# Altium schematic sheet 20_ADC.SchDoc: ADC
size A3; Organization: Lime Microsystems; Address1: Surrey Tech Centre; Address2: Guildford GU2 7YG; Address3: Surrey; Address4: United Kingdom; Revision: v1.2; SheetNumber: 18; SheetTotal: 27
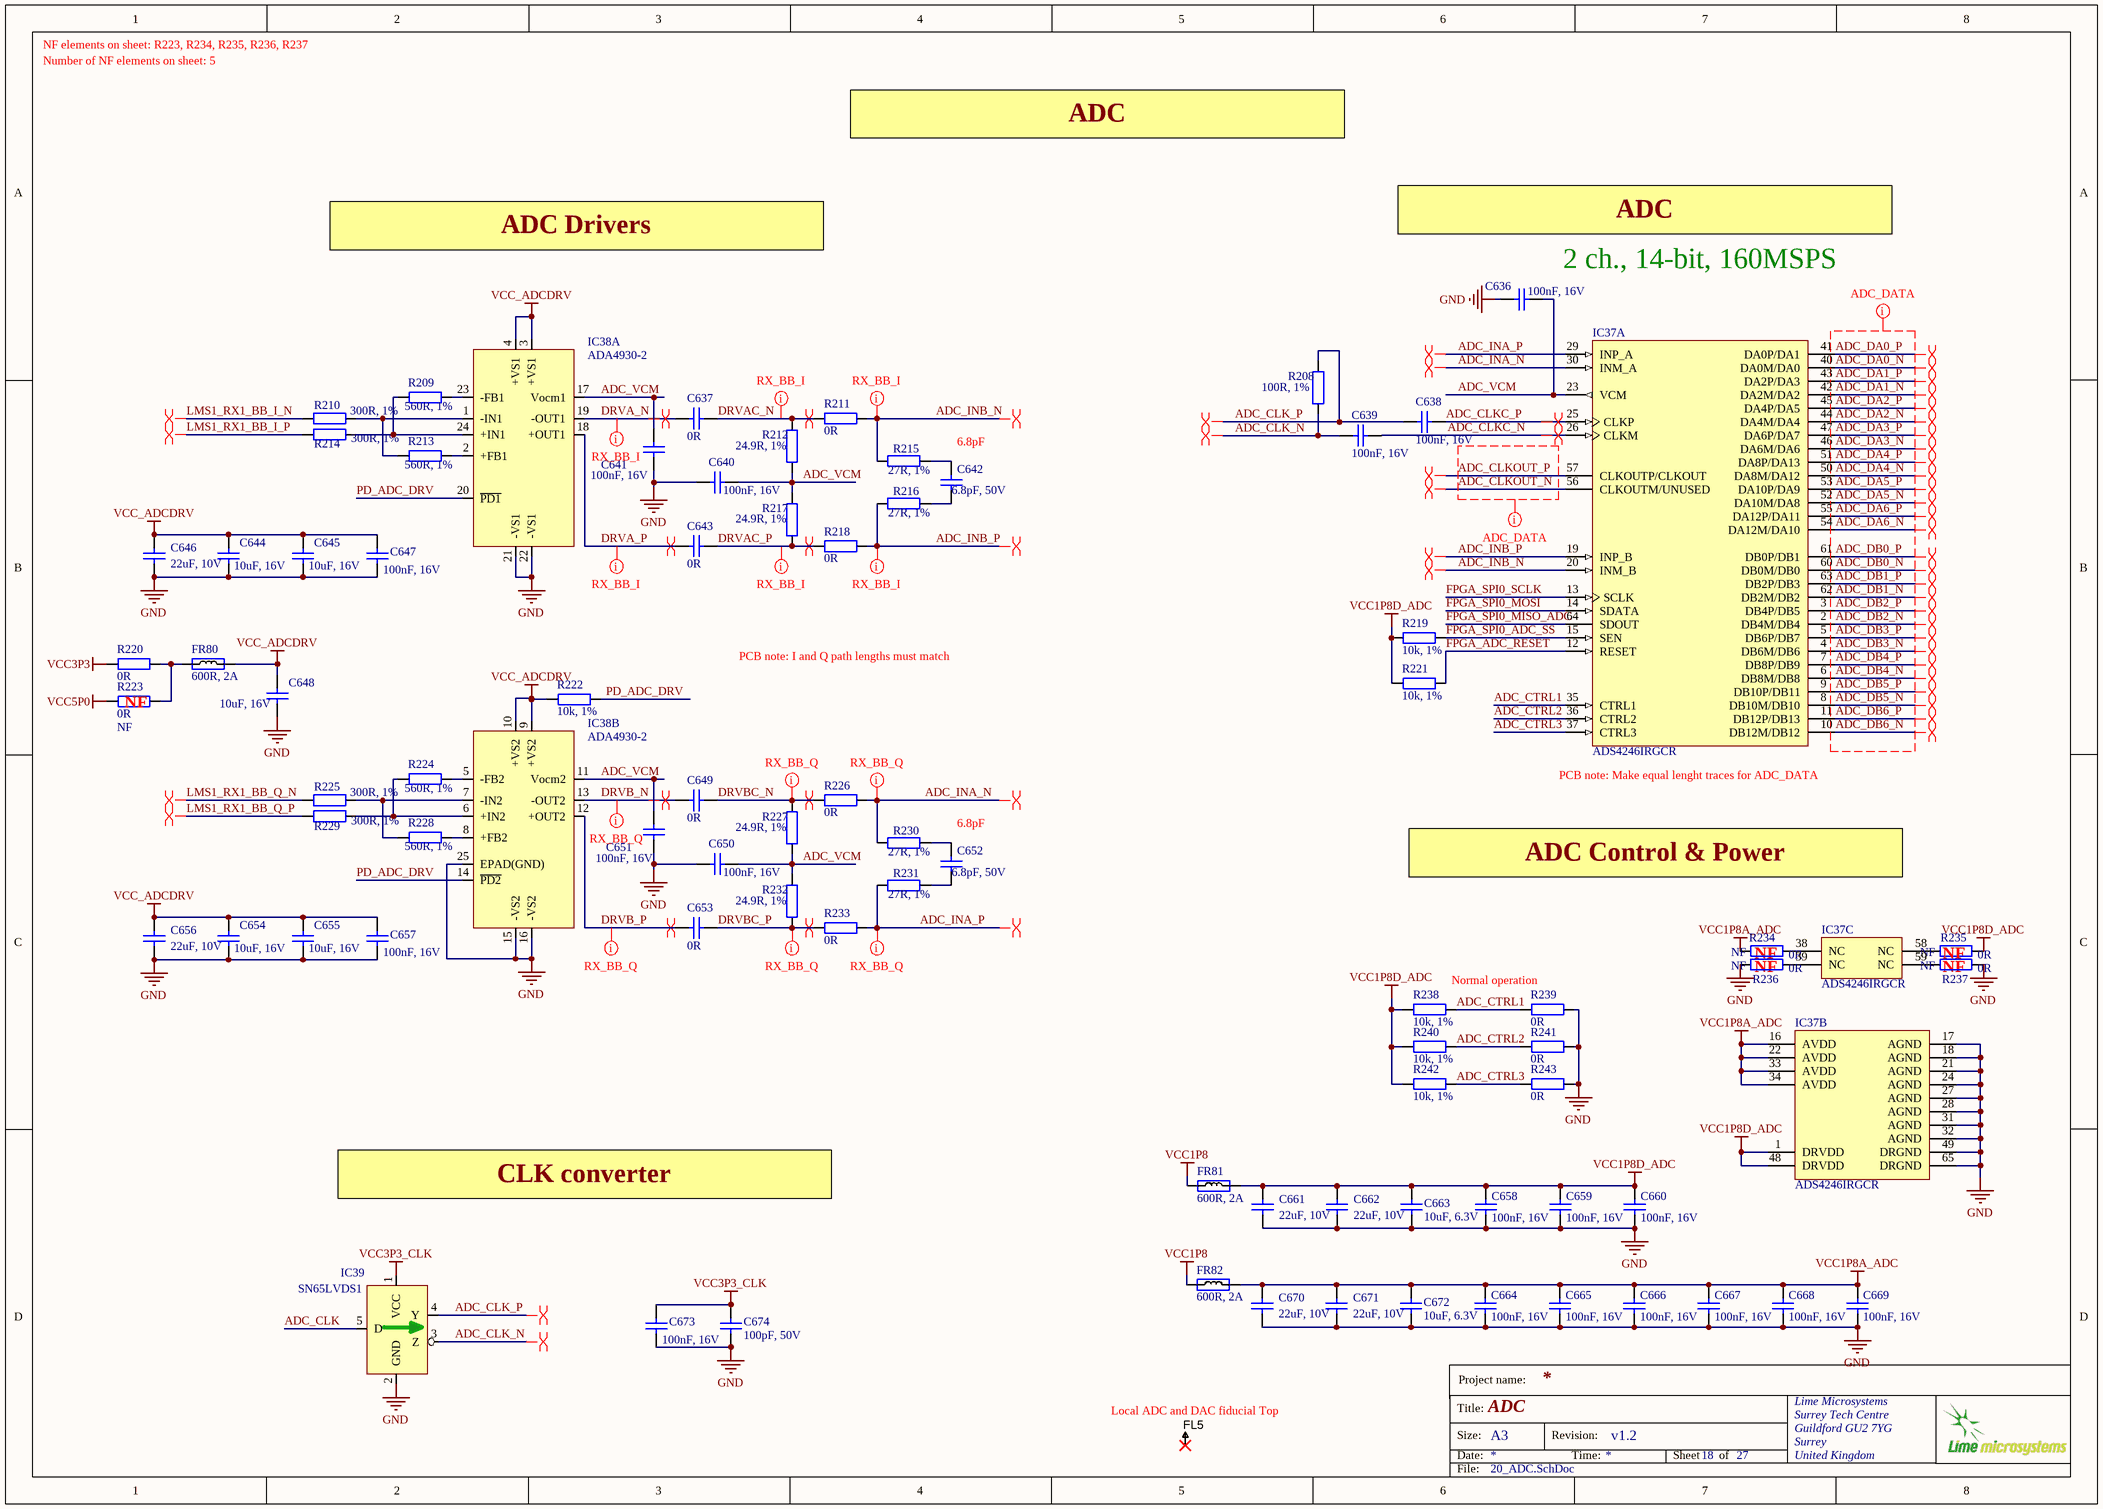
[diagram p0: 20_ADC.SchDoc]

## Parts
C636  100nF, 16V  [CAP0402]
C637  0R  [CAP0402]
C638  100nF, 16V  [CAP0402]
C639  100nF, 16V  [CAP0402]
C640  100nF, 16V  [CAP0402]
C641  100nF, 16V  [CAP0402]
C642  6.8pF, 50V  [CAP0402]
C643  0R  [CAP0402]
C644  10uF, 16V  [CAP0603]
C645  10uF, 16V  [CAP0603]
C646  22uF, 10V  [CAP0603]
C647  100nF, 16V  [CAP0402]
C648  10uF, 16V  [CAP0603]
C649  0R  [CAP0402]
C650  100nF, 16V  [CAP0402]
C651  100nF, 16V  [CAP0402]
C652  6.8pF, 50V  [CAP0402]
C653  0R  [CAP0402]
C654  10uF, 16V  [CAP0603]
C655  10uF, 16V  [CAP0603]
C656  22uF, 10V  [CAP0603]
C657  100nF, 16V  [CAP0402]
C658  100nF, 16V  [CAP0402]
C659  100nF, 16V  [CAP0402]
C660  100nF, 16V  [CAP0402]
C661  22uF, 10V  [CAP0603]
C662  22uF, 10V  [CAP0603]
C663  10uF, 6.3V  [CAP0603]
C664  100nF, 16V  [CAP0402]
C665  100nF, 16V  [CAP0402]
C666  100nF, 16V  [CAP0402]
C667  100nF, 16V  [CAP0402]
C668  100nF, 16V  [CAP0402]
C669  100nF, 16V  [CAP0402]
C670  22uF, 10V  [CAP0603]
C671  22uF, 10V  [CAP0603]
C672  10uF, 6.3V  [CAP0603]
C673  100nF, 16V  [CAP0402]
C674  100pF, 50V  [CAP0402]
FL5  Fiducial  [Fiducial_local]  (value not drawn)
FR80  600R, 2A  [RES0805]
FR81  600R, 2A  [RES0805]
FR82  600R, 2A  [RES0805]
IC37  ADS4246IRGCR  [TI-RGC64-7400X7400TP_V]  (parts A,B,C of 3)
IC38  ADA4930-2  [ADA4930-2_LFCSP-24]  (parts A,B of 2)
IC39  SN65LVDS1  [SOT23-5]
R208  100R, 1%  [RES0402]
R209  560R, 1%  [RES0402]
R210  300R, 1%  [RES0402]
R211  0R  [RES0402]
R212  24.9R, 1%  [RES0402]
R213  560R, 1%  [RES0402]
R214  300R, 1%  [RES0402]
R215  27R, 1%  [RES0402]
R216  27R, 1%  [RES0402]
R217  24.9R, 1%  [RES0402]
R218  0R  [RES0402]
R219  10k, 1%  [RES0402]
R220  0R  [RES0402]
R221  10k, 1%  [RES0402]
R222  10k, 1%  [RES0402]
R223  0R  Assembly Info: NF  [RES0402]
R224  560R, 1%  [RES0402]
R225  300R, 1%  [RES0402]
R226  0R  [RES0402]
R227  24.9R, 1%  [RES0402]
R228  560R, 1%  [RES0402]
R229  300R, 1%  [RES0402]
R230  27R, 1%  [RES0402]
R231  27R, 1%  [RES0402]
R232  24.9R, 1%  [RES0402]
R233  0R  [RES0402]
R234  0R  Assembly Info: NF  [RES0402]
R235  0R  Assembly Info: NF  [RES0402]
R236  0R  Assembly Info: NF  [RES0402]
R237  0R  Assembly Info: NF  [RES0402]
R238  10k, 1%  [RES0402]
R239  0R  [RES0402]
R240  10k, 1%  [RES0402]
R241  0R  [RES0402]
R242  10k, 1%  [RES0402]
R243  0R  [RES0402]

## Nets
GND: C636.1 C640.2 C641.2 C644.1 C645.1 C646.1 C647.2 C648.1 C650.2 C651.2 C654.1 C655.1 C656.1 C657.2 C658.1 C659.1 C660.1 C661.1 C662.1 C663.2 C664.1 C665.1 C666.1 C667.1 C668.1 C669.1 C670.1 C671.1 C672.2 C673.2 C674.1 IC37.17(AGND) IC37.18(AGND) IC37.21(AGND) IC37.24(AGND) IC37.27(AGND) IC37.28(AGND) IC37.31(AGND) IC37.32(AGND) IC37.49(DRGND) IC37.65(DRGND) IC38.15(-VS2) IC38.16(-VS2) IC38.21(-VS1) IC38.22(-VS1) IC38.25(EPAD(GND)) IC39.2(GND) R236.1 R237.2 R239.1 R241.1 R243.1
VCC1P8: FR81.1 FR82.1
VCC1P8A_ADC: C664.2 C665.2 C666.2 C667.2 C668.2 C669.2 C670.2 C671.2 C672.1 FR82.2 IC37.16(AVDD) IC37.22(AVDD) IC37.33(AVDD) IC37.34(AVDD) R234.1
VCC1P8D_ADC: C658.2 C659.2 C660.2 C661.2 C662.2 C663.1 FR81.2 IC37.1(DRVDD) IC37.48(DRVDD) R219.2 R221.2 R235.2 R238.2 R240.2 R242.2
VCC3P3: R220.2
VCC3P3_CLK: C673.1 C674.2 IC39.1(VCC)
VCC5P0: R223.2
VCC_ADCDRV: C644.2 C645.2 C646.2 C647.1 C648.2 C654.2 C655.2 C656.2 C657.1 FR80.2 IC38.3(+VS1) IC38.4(+VS1) IC38.9(+VS2) IC38.10(+VS2) R222.2
ADC_CLK: IC39.5(D)
ADC_CLK_N: C639.2 IC39.3(Z) R208.1
ADC_CLK_P: C638.2 IC39.4(Y) R208.2
ADC_CLKC_N: C639.1 IC37.26(CLKM)
ADC_CLKC_P: C638.1 IC37.25(CLKP)
ADC_CLKOUT_N: IC37.56(CLKOUTM/UNUSED)
ADC_CLKOUT_P: IC37.57(CLKOUTP/CLKOUT)
ADC_CTRL1: IC37.35(CTRL1) R238.1 R239.2
ADC_CTRL2: IC37.36(CTRL2) R240.1 R241.2
ADC_CTRL3: IC37.37(CTRL3) R242.1 R243.2
ADC_DA0_N: IC37.40(DA0M/DA0)
ADC_DA0_P: IC37.41(DA0P/DA1)
ADC_DA1_N: IC37.42(DA2M/DA2)
ADC_DA1_P: IC37.43(DA2P/DA3)
ADC_DA2_N: IC37.44(DA4M/DA4)
ADC_DA2_P: IC37.45(DA4P/DA5)
ADC_DA3_N: IC37.46(DA6M/DA6)
ADC_DA3_P: IC37.47(DA6P/DA7)
ADC_DA4_N: IC37.50(DA8M/DA12)
ADC_DA4_P: IC37.51(DA8P/DA13)
ADC_DA5_N: IC37.52(DA10M/DA8)
ADC_DA5_P: IC37.53(DA10P/DA9)
ADC_DA6_N: IC37.54(DA12M/DA10)
ADC_DA6_P: IC37.55(DA12P/DA11)
ADC_DB0_N: IC37.60(DB0M/DB0)
ADC_DB0_P: IC37.61(DB0P/DB1)
ADC_DB1_N: IC37.62(DB2M/DB2)
ADC_DB1_P: IC37.63(DB2P/DB3)
ADC_DB2_N: IC37.2(DB4M/DB4)
ADC_DB2_P: IC37.3(DB4P/DB5)
ADC_DB3_N: IC37.4(DB6M/DB6)
ADC_DB3_P: IC37.5(DB6P/DB7)
ADC_DB4_N: IC37.6(DB8M/DB8)
ADC_DB4_P: IC37.7(DB8P/DB9)
ADC_DB5_N: IC37.8(DB10M/DB10)
ADC_DB5_P: IC37.9(DB10P/DB11)
ADC_DB6_N: IC37.10(DB12M/DB12)
ADC_DB6_P: IC37.11(DB12P/DB13)
ADC_INA_N: IC37.30(INM_A) R226.1 R230.1
ADC_INA_P: IC37.29(INP_A) R231.1 R233.1
ADC_INB_N: IC37.20(INM_B) R211.1 R215.1
ADC_INB_P: IC37.19(INP_B) R216.1 R218.1
ADC_VCM: C636.2 C640.1 C641.1 C650.1 C651.1 IC37.23(VCM) IC38.11(Vocm2) IC38.17(Vocm1) R212.1 R217.2 R227.1 R232.2
DRVA_N: C637.2 IC38.19(-OUT1)
DRVA_P: C643.2 IC38.18(+OUT1)
DRVAC_N: C637.1 R211.2 R212.2
DRVAC_P: C643.1 R217.1 R218.2
DRVB_N: C649.2 IC38.13(-OUT2)
DRVB_P: C653.2 IC38.12(+OUT2)
DRVBC_N: C649.1 R226.2 R227.2
DRVBC_P: C653.1 R232.1 R233.2
FPGA_ADC_RESET: IC37.12(RESET) R221.1
FPGA_SPI0_ADC_SS: IC37.15(SEN) R219.1
FPGA_SPI0_MISO_ADC: IC37.64(SDOUT)
FPGA_SPI0_MOSI: IC37.14(SDATA)
FPGA_SPI0_SCLK: IC37.13(SCLK)
LMS1_RX1_BB_I_N: R210.2
LMS1_RX1_BB_I_P: R214.2
LMS1_RX1_BB_Q_N: R225.2
LMS1_RX1_BB_Q_P: R229.2
PD_ADC_DRV: IC38.14(~{PD2}) IC38.20(~{PD1}) R222.1
NetC642_1: C642.1 R215.2
NetC642_2: C642.2 R216.2
NetC652_1: C652.1 R230.2
NetC652_2: C652.2 R231.2
NetFR80_1: FR80.1 R220.1 R223.1
NetIC37_38: IC37.38(NC) R234.2
NetIC37_39: IC37.39(NC) R236.2
NetIC37_58: IC37.58(NC) R235.1
NetIC37_59: IC37.59(NC) R237.1
NetIC38_1: IC38.1(-IN1) R210.1 R213.2
NetIC38_2: IC38.2(+FB1) R213.1
NetIC38_5: IC38.5(-FB2) R224.1
NetIC38_6: IC38.6(+IN2) R224.2 R229.1
NetIC38_7: IC38.7(-IN2) R225.1 R228.2
NetIC38_8: IC38.8(+FB2) R228.1
NetIC38_23: IC38.23(-FB1) R209.1
NetIC38_24: IC38.24(+IN1) R209.2 R214.1

Not connected (* = marked no-connect by the designer): FL5 1*

## Layout directives
net class ADC_DB: ADC_CLKOUT_N, ADC_CLKOUT_P, ADC_DA0_N, ADC_DA0_P, ADC_DA1_N, ADC_DA1_P, ADC_DA2_N, ADC_DA2_P, ADC_DA3_N, ADC_DA3_P, ADC_DA4_N, ADC_DA4_P, ADC_DA5_N, ADC_DA5_P, ADC_DA6_N, ADC_DA6_P, ADC_DB0_N, ADC_DB0_P, ADC_DB1_N, ADC_DB1_P, ADC_DB2_N, ADC_DB2_P, ADC_DB3_N, ADC_DB3_P, ADC_DB4_N, ADC_DB4_P, ADC_DB5_N, ADC_DB5_P, ADC_DB6_N, ADC_DB6_P
differential pair: ADC_CLK_N, ADC_CLK_P, ADC_CLKC_N, ADC_CLKC_P, ADC_CLKOUT_N, ADC_CLKOUT_P, ADC_DA0_N, ADC_DA0_P, ADC_DA1_N, ADC_DA1_P, ADC_DA2_N, ADC_DA2_P, ADC_DA3_N, ADC_DA3_P, ADC_DA4_N, ADC_DA4_P, ADC_DA5_N, ADC_DA5_P, ADC_DA6_N, ADC_DA6_P, ADC_DB0_N, ADC_DB0_P, ADC_DB1_N, ADC_DB1_P, ADC_DB2_N, ADC_DB2_P, ADC_DB3_N, ADC_DB3_P, ADC_DB4_N, ADC_DB4_P, ADC_DB5_N, ADC_DB5_P, ADC_DB6_N, ADC_DB6_P, ADC_INA_N, ADC_INA_P, ADC_INB_N, ADC_INB_P, DRVA_N, DRVA_P, DRVAC_N, DRVAC_P, DRVB_N, DRVB_P, DRVBC_N, DRVBC_P, LMS1_RX1_BB_I_N, LMS1_RX1_BB_I_P, LMS1_RX1_BB_Q_N, LMS1_RX1_BB_Q_P
net class RX_BB_Q: ADC_INA_N, ADC_INA_P, DRVB_N, DRVB_P, DRVBC_N, DRVBC_P
net class RX_BB_I: ADC_INB_N, ADC_INB_P, DRVA_N, DRVA_P, DRVAC_N, DRVAC_P

## Notes on the sheet
- NF elements on sheet: R223, R234, R235, R236, R237
- Number of NF elements on sheet: 5
- ADC
- ADC Drivers
- (near C636) 2 ch., 14-bit, 160MSPS
- 6.8pF
- (near R223) NF
- PCB note: I and Q path lengths must match
- (near IC37) PCB note: Make equal lenght traces for ADC_DATA
- ADC Control & Power
- Normal operation
- NF
- CLK converter
- (near FL5) Local ADC and DAC fiducial Top
- Project name:
- Title:
- Size:
- Date:
- A3
- Revision:
- Time:
- Sheet
- of
- File:

## Library data of the parts
C636 C638-C641 C650 C651 C658-C660 C664-C669 = Cap_0603: Part Description: 0.10µF ±10% 16V Ceramic Capacitor X7R 0402 (1005 Metric); Manufacturer Part Number 1: GRM155R71C104KA88D; Brand: Murata Electronics; Tolerance: 10 %; Type: General Purpose MLCC; Capacitance: 0.1 uF; Temperature Coefficient / Code: +/- 15 %; Case Height: 0.5 mm; Case Length: 1 mm; Dielectric: X7R; Supplier 1: Mouser; Supplier Part Number 1: 81-GRM155R71C104KA88; Case Code - in: 0402; Manufacturer: Murata Electronics; Category: Multilayer Ceramic Capacitors MLCC - SMD/SMT; Voltage Rating DC: 16 V; Value: 100nF, 16V; Case Code - mm: 1005; Case Width: 0.5 mm; Manufacturer Part Number: GRM155R71C104KA88D; Maximum Operating Temperature: + 125 C; Minimum Operating Temperature: - 55 C; Minimum Order Quantity: 1; Operating Temperature Range: - 55 C to + 125 C; Package / Case: 0402 (1005 metric); Packaging: Reel; Product: General Type MLCCs; Product Category: Low & Medium Capacitance SMD Ceramic Chip Capacitors; Reeling: True; RoHS - Mouser: Y; RoHS: RoHS Compliant; Series: GRM; Standard Pack Qty: 10000; Termination Style: SMD/SMT
C637 C643 C649 C653 = Cap_0603: Manufacturer: Yageo; Part Description: RES SMD 0.0OHM JUMPER 1/16W 0402; Manufacturer Part Number 1: RC0402JR-070RL; Value: 0R; Composition: Thick Film; Package / Case: 0402 (1005 Metric); Supplier 1: Digi-Key; Supplier Part Number 1: 311-0.0JRTR-ND
C642 C652 = Cap_0603: Manufacturer Part Number: GRM1555C1H6R8BA01D; Manufacturer: Murata Electronics North America; Part Description: 6.8pF ±0.1pF 50V Ceramic Capacitor C0G, NP0 0402 (1005 Metric); Temperature Coefficient: C0G, NP0; Tolerance: ±0.1pF; Value: 6.8pF, 50V; Supplier 1: Digi-Key; Applications: General Purpose; Packaging: Cut Tape (CT); Voltage - Rated: 50V; Lead Spacing: -; Mounting Type: Surface Mount, MLCC; Supplier Part Number 1: 490-6252-1-ND; Operating Temperature: -55°C ~ 125°C; Capacitance: 6.8pF; Size / Dimension: 0.039" L x 0.020" W (1.00mm x 0.50mm); Lead Style: -; Height - Seated (Max): -; Category: Capacitors; RoHS: RoHS Compliant; Thickness (Max): 0.022" (0.55mm); Features: -; Package / Case: 0402 (1005 Metric); Ratings: -
C644 C645 C648 C654 C655 = Cap_0603: Manufacturer: Yageo; Manufacturer Part Number 1: GRM188R61C106MA73D; Part Description: 10µF ±20% 16V Ceramic Capacitor X5R 0603 (1608 Metric); Temperature Coefficient: X5R; Capacitance: 10µF; Tolerance: ±20%; Value: 10uF, 16V; Supplier 1: Digi-Key; Supplier Part Number 1: 490-7201-2-ND; Category: Capacitors; Ratings: -; Features: -; Lead Style: -; Package / Case: 0603 (1608 Metric); Lead Spacing: -; Applications: General Purpose; Voltage - Rated: 16V; Operating Temperature: -55°C ~ 85°C; Thickness (Max): 0.039" (1.00mm); Mounting Type: Surface Mount, MLCC; RoHS: RoHS Compliant; Size / Dimension: 0.063" L x 0.031" W (1.60mm x 0.80mm); Packaging: Tape & Reel (TR); Height - Seated (Max): -
C646 C656 C661 C662 C670 C671 = Cap_0603: Manufacturer Part Number 1: C1608X5R1A226M080AC; Part Description: 22µF ±20% 10V Ceramic Capacitor X5R 0603 (1608 Metric); Manufacturer: TDK Corporation; Brand: TDK; Temperature Coefficient / Code: +/- 15 %; Tolerance: 20 %; Type: Multilayer Ceramic Chip Capacitor; Supplier 1: Mouser; Supplier Part Number 1: 810-C1608X5R1A226M; Package / Case: 0603 (1608 metric); Category: Multilayer Ceramic Capacitors MLCC - SMD/SMT; Capacitance: 22uF; Operating Temperature Range: - 55 C to + 85 C; Case Code - in: 0603; Voltage Rating DC: 10 V; Case Code - mm: 1608; Value: 22uF, 10V
C647 C657 C673 = Cap_0603: Manufacturer Part Number 1: GRM155R71C104KA88D; Part Description: 0.10µF ±10% 16V Ceramic Capacitor X7R 0402 (1005 Metric); Brand: Murata Electronics; Tolerance: 10 %; Type: General Purpose MLCC; Capacitance: 0.1 uF; Temperature Coefficient / Code: +/- 15 %; Case Height: 0.5 mm; Case Length: 1 mm; Dielectric: X7R; Supplier 1: Mouser; Supplier Part Number 1: 81-GRM155R71C104KA88; Case Code - in: 0402; Manufacturer: Murata Electronics; Category: Multilayer Ceramic Capacitors MLCC - SMD/SMT; Voltage Rating DC: 16 V; Value: 100nF, 16V; Manufacturer Part Number: GRM155R71C104KA88D; Case Code - mm: 1005; Case Width: 0.5 mm; Maximum Operating Temperature: + 125 C; Minimum Operating Temperature: - 55 C; Minimum Order Quantity: 1; Operating Temperature Range: - 55 C to + 125 C; Package / Case: 0402 (1005 metric); Packaging: Reel; Product: General Type MLCCs; Product Category: Low & Medium Capacitance SMD Ceramic Chip Capacitors; Reeling: True; RoHS - Mouser: Y; RoHS: RoHS Compliant; Series: GRM; Standard Pack Qty: 10000; Termination Style: SMD/SMT
C663 C672 = Cap_0603: Manufacturer Part Number 1: CC0603MRX5R5BB106; Part Description: 10µF ±20% 6.3V Ceramic Capacitor X5R 0603 (1608 Metric); Manufacturer: Yageo; Capacitance: 10µF; Tolerance: ±20%; Supplier 1: Digi-Key; Supplier Part Number 1: 311-1448-2-ND; Package / Case: 0603 (1608 Metric); Category: Capacitors; Voltage - Rated: 6.3V; Value: 10uF, 6.3V
C674 = Cap_0402: Manufacturer Part Number 1: CC0402JRNPO9BN101; Manufacturer: Yageo; Part Description: 100pF ±5% 50V C0G, NP0 Ceramic Capacitor -55°C ~ 125°C Surface Mount, MLCC 0402 (1005 Metric) 0.039" L x 0.020" W (1.00mm x 0.50mm); Temperature Coefficient: C0G, NP0; Tolerance: ±5%; Value: 100pF, 50V; Supplier 1: Digi-Key; Supplier Part Number 1: 311-1024-1-ND; RoHS: RoHS Compliant; Category: Capacitors; Applications: General Purpose; Mounting Type: Surface Mount, MLCC; Capacitance: 100pF; Ratings: -; Packaging: Cut Tape (CT); Voltage - Rated: 50V; Size / Dimension: 0.039" L x 0.020" W (1.00mm x 0.50mm); Height - Seated (Max): -; Package / Case: 0402 (1005 Metric); Operating Temperature: -55°C ~ 125°C; Features: -; Lead Spacing: -; Lead Style: -; Thickness (Max): 0.022" (0.55mm)
FR80 = Ferrite: Manufacturer Part Number 1: MPZ2012S601A; Manufacturer: TDK; Part Description: FERRITE BEAD 600 OHM 0805 1LN; Filter Type: Differential Mode - Single; Impedance @ Frequency: 600 Ohm @ 100MHz; DC Resistance (DCR): 100 mOhm Max; DC Current Rating: 2; DC Resistance Max: 0.1; Ferrite Case Style: 0805 [2012 Metric]; Ferrite Mounting: SMD; Impedance @ 100MHz: 600; Impedance Tolerance: ± 25%; Supplier 1: Farnell; Supplier Part Number 1: 1669753RL; Mounting Type: Surface Mount; RoHS: RoHS Compliant; Height (Max): 0.041" (1.05mm); Packaging: Tape & Reel (TR); Category: Filters; Current Rating: 2A; Package / Case: 0805 (2012 Metric); Size / Dimension: 0.079" L x 0.049" W (2.00mm x 1.25mm); Value: 600R, 2A; Core Material: Ferrite; Supplier: Farnell
FR81 FR82 = Ferrite: Manufacturer Part Number 1: MPZ2012S601A; Manufacturer: TDK; Part Description: FERRITE BEAD 600 OHM 0805 1LN; Impedance Tolerance: ± 25%; Impedance @ 100MHz: 600; Ferrite Mounting: SMD; DC Resistance Max: 0.1; DC Current Rating: 2; Ferrite Case Style: 0805 [2012 Metric]; DC Resistance (DCR): 100 mOhm Max; Filter Type: Differential Mode - Single; Impedance @ Frequency: 600 Ohm @ 100MHz; Supplier 1: Farnell; Supplier Part Number 1: 1669753RL; Supplier: Farnell; Core Material: Ferrite; Value: 600R, 2A; Category: Filters; Current Rating: 2A; Height (Max): 0.041" (1.05mm); Mounting Type: Surface Mount; Package / Case: 0805 (2012 Metric); Packaging: Tape & Reel (TR); RoHS: RoHS Compliant; Size / Dimension: 0.079" L x 0.049" W (2.00mm x 1.25mm)
IC37 = ADS4246IRGCR: 14-Bit 160 MSPS Dual Low Power ADC, -40 to 85 degC, 64-pin QFN (RGC64), Green (RoHS & no Sb/Br); Manufacturer: Texas Instruments; Manufacturer Part Number 1: ADS4246IRGCT; Part Description: 14 Bit Analog to Digital Converter 2 Input 2 Pipelined 64-VQFN (9x9); Number of Bits: 14; Sampling Rate (Per Second): 160M; Number of Inputs: 2; Input Type: Differential; Data Interface: LVDS - Parallel, Parallel; Configuration: S/H-ADC; Ratio - S/H:ADC: 1:1; Architecture: Pipelined; Reference Type: Internal; Voltage - Supply, Analog: 1.7 V ~ 1.9 V; Supplier 1: Digi-Key; Supplier Part Number 1: 296-28772-1-ND; RoHS: RoHS Compliant; Category: Integrated Circuits (ICs); Stock 1: 83; Pricing 1: 1=95.91, 10=90.96, 100=82.2967 (USD); Packaging: Cut Tape (CT); Part Status: Active; Number of A/D Converters: 2; Voltage - Supply, Digital: 1.7 V ~ 1.9 V; Features: Simultaneous Sampling; Operating Temperature: -40°C ~ 85°C; Package / Case: 64-VFQFN Exposed Pad; Supplier Device Package: 64-VQFN (9x9); ComponentLink1URL: http://www.ti.com/lit/ds/symlink/ads4246.pdf; ComponentLink1Description: http://www.ti.com/lit/ds/symlink/ads4246.pdf
IC38 = ADA4930-2: Manufacturer: Analog Devices Inc.; Manufacturer Part Number 1: ADA4930-2YCPZ-R7; Part Description: Differential Amplifier 2 Circuit Differential 24-LFCSP-WQ (4x4); Amplifier Type: Differential; Voltage - Supply, Single/Dual (±): 3.3V, 5V; Number of Circuits: 2; Current - Supply: 34mA; Slew Rate: 3400 V/µs; Voltage - Input Offset: 150µV; Current - Input Bias: 23µA; -3db Bandwidth: 1.35GHz; Current - Output / Channel: 30mA; Supplier 1: Digi-Key; Mounting Type: Surface Mount; Gain Bandwidth Product: -; Supplier Device Package: 24-LFCSP-VQ (4x4); Category: Integrated Circuits (ICs); Operating Temperature: -40°C ~ 105°C; Packaging: Cut Tape (CT); RoHS: RoHS Compliant; Package / Case: 24-VFQFN Exposed Pad, CSP; Output Type: Differential; Supplier Part Number 1: ADA4930-2YCPZ-R7CT-ND
IC39 = SN65LVDS1: Manufacturer: TEXAS INSTRUMENTS; Manufacturer Part Number 1: SN65LVDS1DBVR; Part Description: DIFFERENTIAL LINE DRIVER/RECEIVER SIGNAL SOT23-5; Supply Voltage Min: 2.4; Supply Voltage Max: 3.6; No. of Pins: 5; Driver Case Style: SOT-23; Supplier 1: Newark; Supplier Part Number 1: 76C0715
R208 = Res_0402: Manufacturer Part Number 1: RMCF0402FT100R; Part Description: RES SMD 100 OHM 1% 1/16W 0402; Manufacturer: Stackpole Electronics Inc.; Temperature Coefficient: ±100ppm/°C; Supplier 1: Digi-Key; Supplier Part Number 1: RMCF0402FT100RDKR-ND; Package / Case: 0402 (1005 Metric); Composition: Thick Film; Category: Resistors; Tolerance: ±1%; Value: 100R, 1%
R209 R213 R224 R228 = Res_0402: Manufacturer: Vishay Dale; Part Description: RES SMD 560 OHM 1% 1/16W 0402; Manufacturer Part Number 1: CRCW0402560RFKED; Resistance (Ohms): 560; Temperature Coefficient: ±100ppm/°C; Power (Watts): 0.063W, 1/16W; Value: 560R, 1%; Supplier Device Package: 0402 (1005 Metric); Composition: Thick Film; Packaging: Cut Tape (CT); Number of Terminations: 2; Operating Temperature: -55°C ~ 155°C; Supplier Part Number 1: 541-560LCT-ND; Supplier 1: Digi-Key; Category: Resistors; Height: 0.016" (0.40mm); Features: Automotive AEC-Q200; Size / Dimension: 0.039" L x 0.020" W (1.00mm x 0.50mm); Tolerance: ±1%; Package / Case: 0402 (1005 Metric); RoHS: RoHS Compliant
R210 R214 R225 R229 = Res_0402: Manufacturer: Vishay Dale; Part Description: RES SMD 300 OHM 1% 1/16W 0402; Manufacturer Part Number 1: CRCW0402300RFKED; Resistance (Ohms): 300; Temperature Coefficient: ±100ppm/°C; Power (Watts): 0.063W, 1/16W; Value: 300R, 1%; Supplier 1: Digi-Key; Supplier Device Package: 0402 (1005 Metric); Composition: Thick Film; Features: Automotive AEC-Q200; Packaging: Cut Tape (CT); Size / Dimension: 0.039" L x 0.020" W (1.00mm x 0.50mm); Category: Resistors; Package / Case: 0402 (1005 Metric); Supplier Part Number 1: 541-300LCT-ND; Number of Terminations: 2; Tolerance: ±1%; Height: 0.016" (0.40mm); Operating Temperature: -55°C ~ 155°C; RoHS: RoHS Compliant
R211 R218 R226 R233-R237 R239 R241 R243 = Res_0402: Manufacturer: Yageo; Part Description: RES SMD 0.0OHM JUMPER 1/16W 0402; Manufacturer Part Number 1: RC0402JR-070RL; Supplier 1: Digi-Key; Supplier Part Number 1: 311-0.0JRTR-ND; Composition: Thick Film; Package / Case: 0402 (1005 Metric); Category: Resistors; Value: 0R
R212 R217 R227 R232 = Res_0402: Manufacturer: Vishay Dale; Part Description: RES SMD 24.9 OHM 1% 1/16W 0402; Manufacturer Part Number 1: CRCW040224R9FKED; Power (Watts): 0.063W, 1/16W; Temperature Coefficient: ±100ppm/°C; Resistance (Ohms): 24.9; Value: 24.9R, 1%; Category: Resistors; Supplier Device Package: 0402 (1005 Metric); Size / Dimension: 0.039" L x 0.020" W (1.00mm x 0.50mm); Number of Terminations: 2; Height: 0.016" (0.40mm); Packaging: Cut Tape (CT); Package / Case: 0402 (1005 Metric); Tolerance: ±1%; Operating Temperature: -55°C ~ 155°C; Composition: Thick Film; Supplier Part Number 1: 541-24.9LCT-ND; Features: Automotive AEC-Q200; Supplier 1: Digi-Key; RoHS: RoHS Compliant
R215 R216 R230 R231 = Res_0402: Manufacturer: Vishay Dale; Part Description: RES SMD 27 OHM 1% 1/16W 0402; Manufacturer Part Number 1: CRCW040227R0FKED; Temperature Coefficient: ±100ppm/°C; Power (Watts): 0.063W, 1/16W; Resistance (Ohms): 27; Value: 27R, 1%; Package / Case: 0402 (1005 Metric); Height: 0.016" (0.40mm); Supplier 1: Digi-Key; Supplier Part Number 1: 541-27.0LCT-ND; Size / Dimension: 0.039" L x 0.020" W (1.00mm x 0.50mm); Number of Terminations: 2; Category: Resistors; Tolerance: ±1%; RoHS: RoHS Compliant; Composition: Thick Film; Supplier Device Package: 0402 (1005 Metric); Operating Temperature: -55°C ~ 155°C; Packaging: Cut Tape (CT); Features: Automotive AEC-Q200
R219 R221 R222 R238 R240 R242 = Res_0402: Manufacturer: Yageo; Manufacturer Part Number 1: RC0402FR-0710KL; Part Description: RES SMD 10K OHM 1% 1/16W 0402; Temperature Coefficient: ±100ppm/°C; Power (Watts): 0.063W, 1/16W; Value: 10k, 1%; Supplier 1: Digi-Key; Supplier Part Number 1: 311-10.0KLRTR-ND; Resistance (Ohms): 10k; Packaging: Tape & Reel (TR); RoHS: RoHS Compliant; Package / Case: 0402 (1005 Metric); Tolerance: ±1%; Operating Temperature: -55°C ~ 155°C; Size / Dimension: 0.039" L x 0.020" W (1.00mm x 0.50mm); Number of Terminations: 2; Category: Resistors; Height: 0.016" (0.40mm); Supplier Device Package: 0402; Features: Moisture Resistant; Composition: Thick Film
R220 R223 = Res_0402: Manufacturer Part Number 1: RC0402JR-070RL; Manufacturer: Yageo; Part Description: RES SMD 0.0OHM JUMPER 1/16W 0402; Resistance (Ohms): 0.0; Tolerance: Jumper; Power (Watts): 0.063W, 1/16W; Value: 0R; Supplier 1: Digi-Key; Supplier Part Number 1: 311-0.0JRTR-ND; Category: Resistors; Temperature Coefficient: -; Features: Moisture Resistant; Supplier Device Package: 0402; Height: 0.016" (0.40mm); Package / Case: 0402 (1005 Metric); Operating Temperature: -55°C ~ 155°C; Size / Dimension: 0.039" L x 0.020" W (1.00mm x 0.50mm); Composition: Thick Film; Packaging: Tape & Reel (TR); Number of Terminations: 2; RoHS: RoHS Compliant